# Altium schematic sheet LCL_12V_chp.SchDoc
size A4; Organization: Altium Limited; Address1: L3, 12a Rodborough Rd; Address2: Frenchs Forest; Address3: NSW; Address4: Australia 2086; DocumentNumber: 12; SheetNumber: 12; SheetTotal: 19
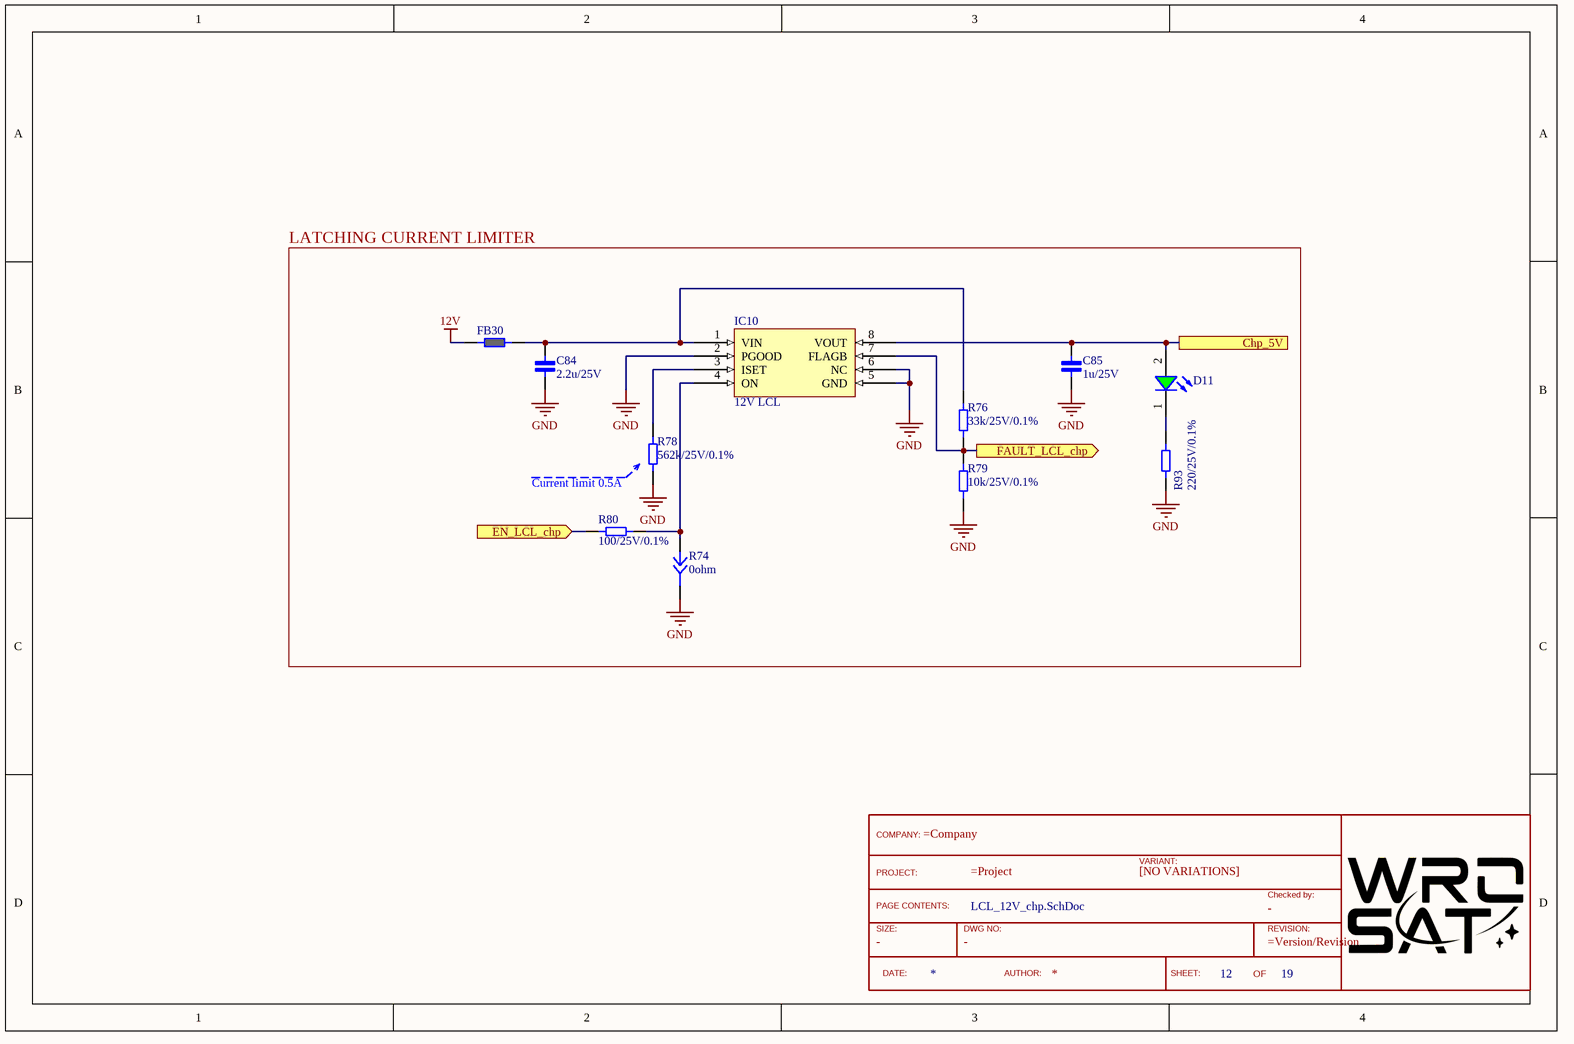
[diagram p0: LCL_12V_chp.SchDoc]

## Parts
?  TitleBlock  (value not drawn)  (graphical)
C84  2.2u/25V  [CAP_0603]
C85  1u/25V  [CAP_0603]
D11  Green, 3.2V  [WL-SMCW_0603_H=0.7mm]  (value not drawn)
FB30  Ferrite_bead_0603  [Ferrite_0603]  (value not drawn)
IC10  12V LCL  [SO8]
R74  0ohm  [Jumper 2]
R76  33k/25V/0.1%  [RES_0402]
R78  562k/25V/0.1%  [RES_0402]
R79  10k/25V/0.1%  [RES_0402]
R80  100/25V/0.1%  [RES_0402]
R93  220/25V/0.1%  [RES_0402]

## Blocks framed on the sheet
LATCHING CURRENT LIMITER: C84 C85 D11 FB30 IC10 R74 R76 R78-R80 R93

## Ports
Chp_5V, EN_LCL_chp (in), FAULT_LCL_chp (out)

## Nets
12V: FB30.1
GND: C84.1 C85.1 IC10.2(PGOOD) IC10.5(GND) IC10.6(NC) R74.2 R78.1 R79.1 R93.1
Chp_5V: C85.2 D11.2(A) IC10.8(VOUT) ; port Chp_5V
EN_LCL_chp: R80.2 ; port EN_LCL_chp
FAULT_LCL_chp: IC10.7(FLAGB) R76.1 R79.2 ; port FAULT_LCL_chp
NetC84_2: C84.2 FB30.2 IC10.1(VIN) R76.2
NetD11_1: D11.1(K) R93.2
NetIC10_3: IC10.3(ISET) R78.2
NetIC10_4: IC10.4(ON) R74.1 R80.1

## Notes on the sheet
- (near R78) Current limit 0.5A
- Title
- Size:
- Date:
- A3
- Number:
- Time:
- Revision:
- Sheet
- of
- File:
- (in symbol TitleBlock) COMPANY:; VARIANT:; PROJECT:; [NO VARIATIONS]; Checked by:; PAGE CONTENTS:; SIZE:; DWG NO:; REVISION:; DATE:; AUTHOR:; SHEET:; OF

## Library data of the parts
? = TitleBlock: Standard TitleBlock; DrawingNo: -; Size: -; Checked: -
C84 = Cap_0603_2.2u_25v: Ceramic Capacitor 2.2uF / 0603 / 25V / ±5%, Wurth Elektronik MLCC
C85 = Cap_0603_1u_25v: Ceramic Capacitor 1uF / 0603 / 25V / ±5%, Wurth Elektronik MLCC
D11 = 150060GS75000: WL-SMCW SMT Mono-color Chip LED Waterclear, size 0603, Green, 3.2V, 140deg; Chip Technology: InGaN; Dominant Wavelength typ.: 525nm; Luminous Intensity typ.: 430mcd; Peak Wavelength typ.: 515nm; Viewing Angle: 140deg; ComponentLink1Description: Manufacturer; ComponentLink1URL: http://www.we-online.de; ComponentLink2URL: https://www.we-online.com/catalog/datasheet/150060GS75000.pdf; ComponentLink2Description: Datasheet; Forward Voltage typ.: 3.2V; Emitting Color: Green; Mounting Technology: SMT; Operating Temperature: -40 to +85degC; Published Date: December 2019; Part Number: 150060GS75000; Packaging: Tape and Reel; Size: 0603; Publisher: Wurth Elektronik
FB30 = Ferrite_bead_0603: Ferrite bead
IC10 = FPF2700: FPF270xMX
R74 = Mini jumper
R76 = Res_0402_33k: Vishay, thin film resistor 33k/25V/0.1%
R78 = Res_0402_562k: Vishay, thin film resistor 562k/25V/0.1%
R79 = Res_0402_10k: Vishay, thin film resistor 10k/25V/0.1%
R80 = Res_0402_100: Vishay, thin film resistor 100/25V/0.1%
R93 = Res_0402_1: Vishay, thin film resistor 1/25V/0.1%